# Altium schematic sheet 6 - Position2Go_Debugger.SchDoc
size A3; Release: RC00; PageSetup: Record=PageOptions|CenterHorizontal=True|CenterVertical=True|PrintScale=1.01|XCorrection=1.00|YCorrection=1.00|PrintKind=0|BorderSize=5000000|LeftOffset=0|BottomOffset=0|Orientation=2|PaperLength=1000|PaperWidth=1000|Scale=100|PaperSource=7|PrintQuality=-4|MediaType=1|DitherType=10|PaperKind=A3|PrintScaleMode=1; Doc_ConfidentialStatus: <Doc_ConfidentialStatus>; Doc_Preliminary: <Doc_Preliminary>
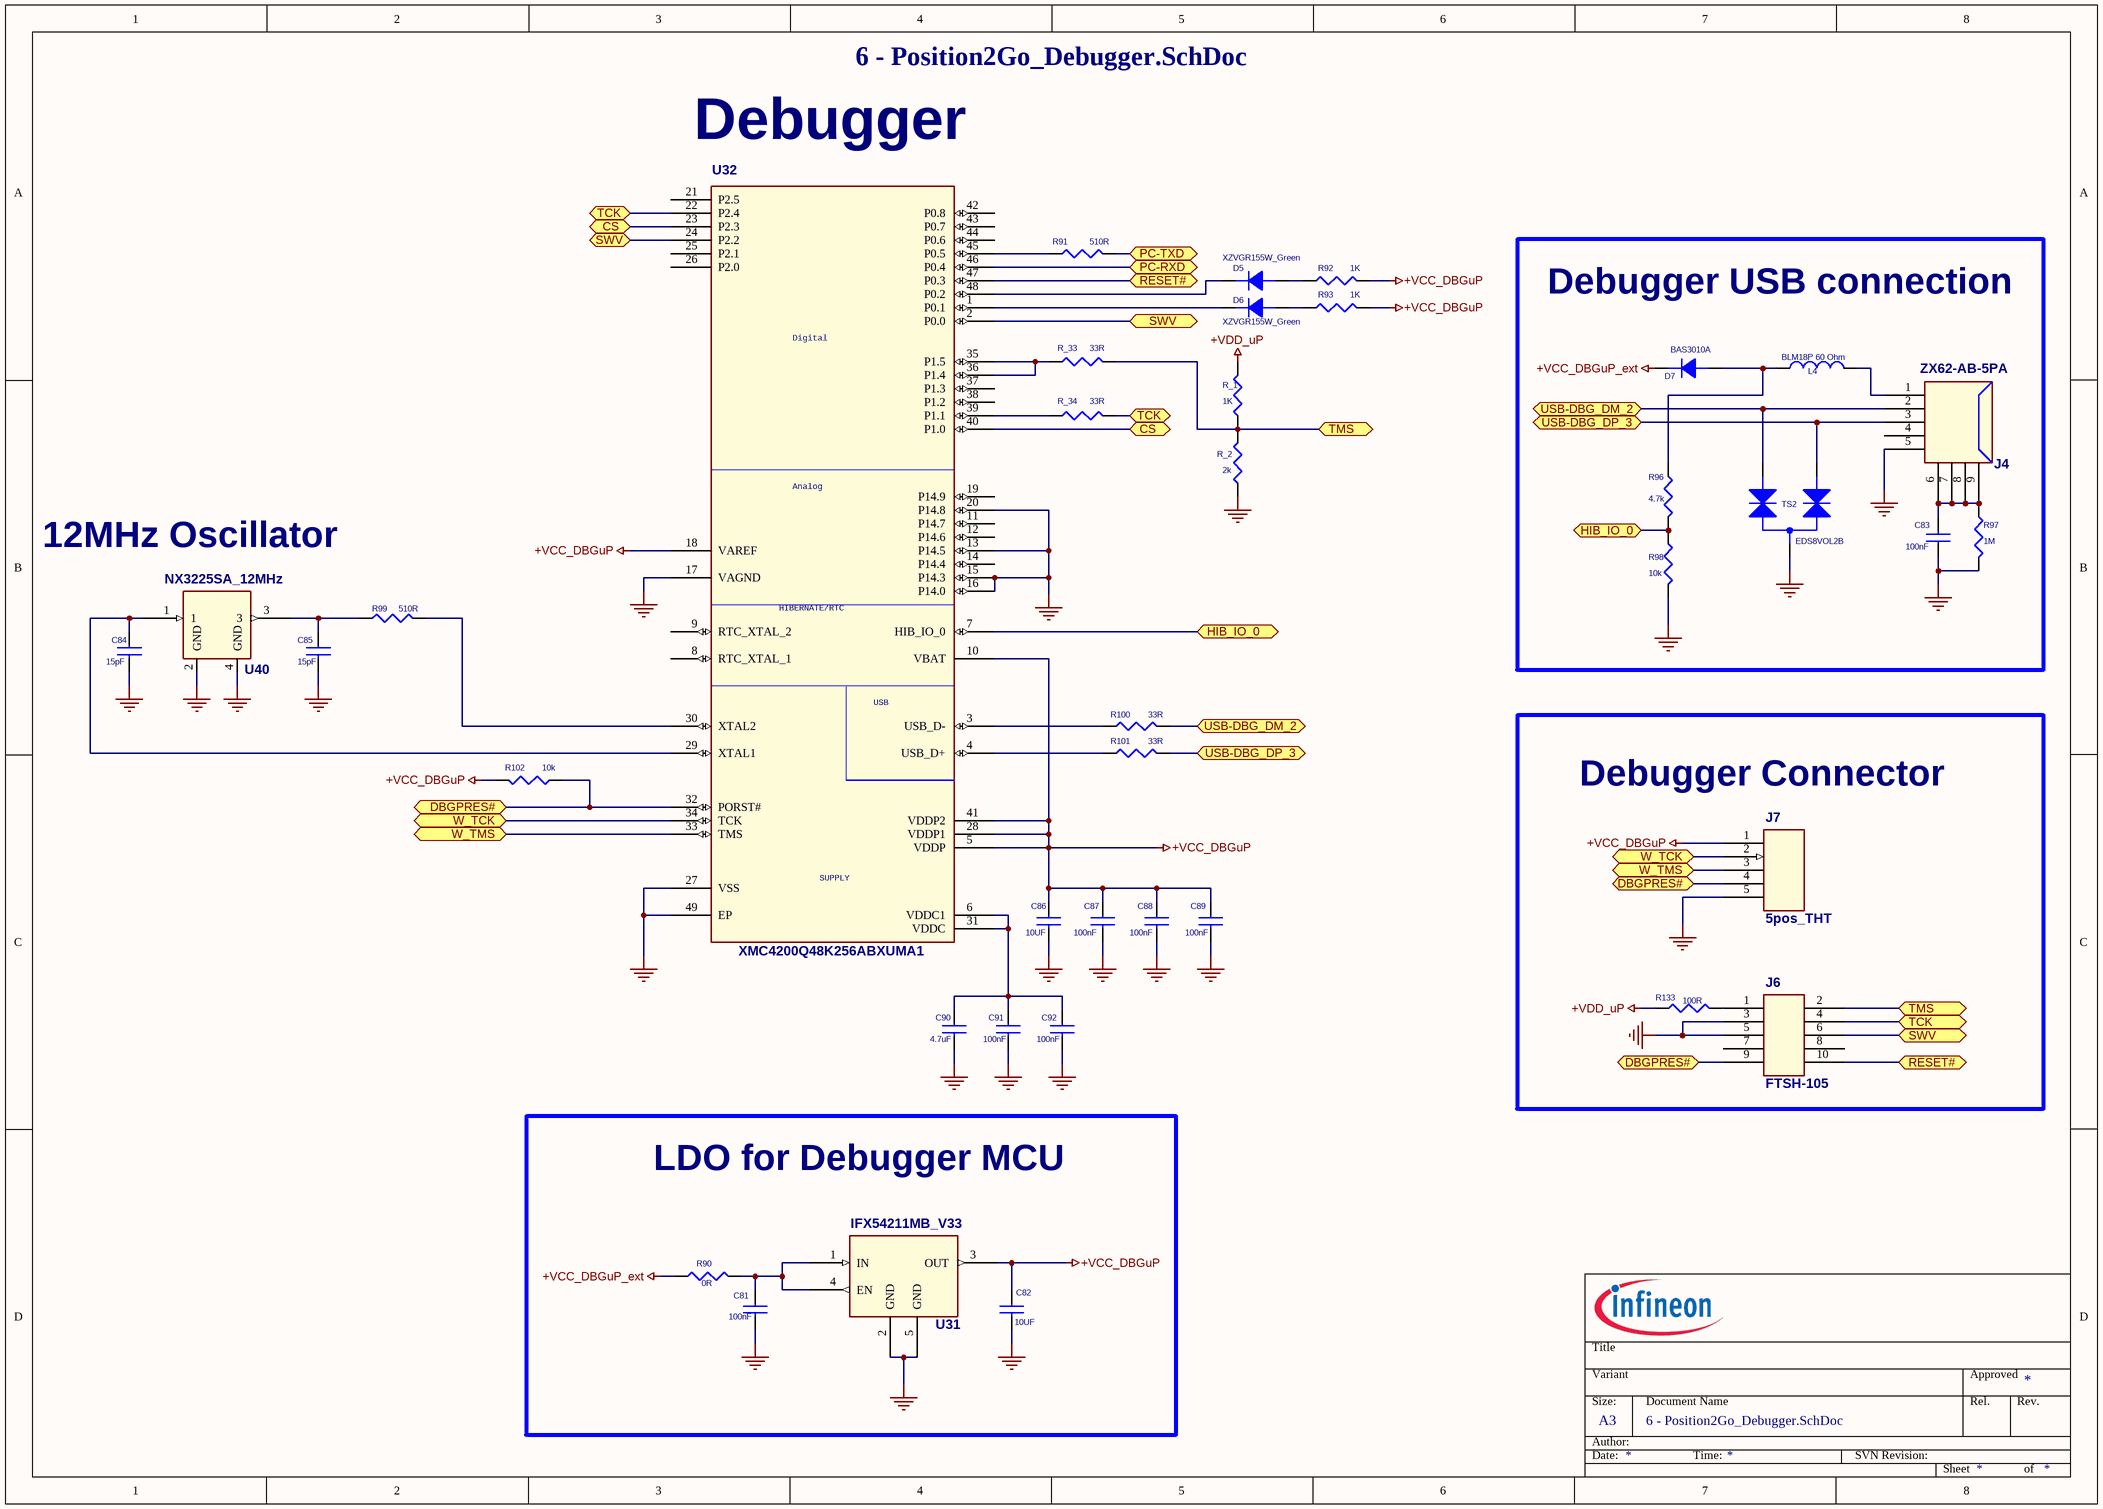
[diagram p0: 6 - Position2Go_Debugger.SchDoc]

## Parts
C81  100nF  [0402_durac]
C82  10UF  [0402_durac]
C83  100nF  [0402_durac]
C84  15pF  [0402_durac]
C85  15pF  [0402_durac]
C86  10UF  [0402_durac]
C87  100nF  [0402_durac]
C88  100nF  [0402_durac]
C89  100nF  [0402_durac]
C90  4.7uF  [0402_durac]
C91  100nF  [0402_durac]
C92  100nF  [0402_durac]
D5  XZVGR155W_Green  [LED_0201]
D6  XZVGR155W_Green  [LED_0201]
D7  BAS3010A  [sod323]
J4  ZX62-AB-5PA  [micro_AB_ZX62]
J6  FTSH-105  [CON_10_pin_uP_FTSH]
J7  5pos_THT  [con_5pin_254p]
L4  BLM18P 60 Ohm  [L_0603]
R90  0R  [0402_durac]
R91  510R  [0402_durac]
R92  1K  [R_0201]
R93  1K  [R_0201]
R96  4.7k  [0402_durac]
R97  1M  [0402_durac]
R98  10k  [0402_durac]
R99  510R  [0402_durac]
R100  33R  [0402_durac]
R101  33R  [0402_durac]
R102  10k  [0402_durac]
R133  100R  [0402_durac]
R_1  1K  [R_0201]
R_2  2k  [R_0201]
R_33  33R  [R_0201]
R_34  33R  [R_0201]
TS2  EDS8VOL2B  [ESD8VOL2B]
U31  IFX54211MB_V33  [inf-pg-sct595v]
U32  XMC4200Q48K256ABXUMA1  [inf-pg-vqfn-48-_-5200x5200tp_n]
U40  NX3225SA_12MHz  [NX3225SA]

## Blocks framed on the sheet
Debugger USB connection: C83 D7 J4 L4 R96-R98 TS2
Debugger Connector: J6 J7 R133
LDO for Debugger MCU: C81 C82 R90 U31

## Ports
CS (bidir), DBGPRES# (bidir), HIB_IO_0 (bidir), PC-RXD (bidir), PC-TXD (bidir), RESET# (bidir), SWV (bidir), TCK (bidir), TMS (bidir), USB-DBG_DM_2 (bidir), USB-DBG_DP_3 (bidir), W_TCK (bidir), W_TMS (bidir)

## Nets
+VCC_DBGuP: C82.1 C86.1 C87.1 C88.1 C89.1 J7.1 R92.2 R93.2 R102.2 U31.3(OUT) U32.5(VDDP) U32.10(VBAT) U32.18(VAREF) U32.28(VDDP1) U32.41(VDDP2)
+VCC_DBGuP_ext: D7.1(K) R90.1
+VDD_uP: R133.2 R_1.2
GND_POWER: C81.2 C82.2 C83.1 C84.2 C85.2 C86.2 C87.2 C88.2 C89.2 C90.2 C91.2 C92.2 J4.5 J6.3 J6.5 J7.5 R97.2 R98.2 R_2.1 TS2.3 U31.2(GND) U31.5(GND) U32.13(P14.5) U32.15(P14.3) U32.16(P14.0) U32.17(VAGND) U32.20(P14.8) U32.27(VSS) U32.49(EP) U40.2(GND) U40.4(GND)
CS: U32.23(P2.3) U32.40(P1.0) ; port CS
DBGPRES#: J6.9 J7.4 R102.1 U32.32(PORST#) ; port DBGPRES#
HIB_IO_0: R96.2 R98.1 U32.7(HIB_IO_0) ; port HIB_IO_0
PC-RXD: U32.46(P0.4) ; port PC-RXD
PC-TXD: R91.2 ; port PC-TXD
RESET#: J6.10 U32.47(P0.3) ; port RESET#
SWV: J6.6 U32.2(P0.0) U32.24(P2.2) ; port SWV
TCK: J6.4 R_34.2 U32.22(P2.4) ; port TCK
TMS: J6.2 R_1.1 R_2.2 R_33.2 ; port TMS
USB-DBG_DM_2: J4.2 R100.2 TS2.1 ; port USB-DBG_DM_2
USB-DBG_DP_3: J4.3 R101.2 TS2.2 ; port USB-DBG_DP_3
W_TCK: J7.2 U32.34(TCK) ; port W_TCK
W_TMS: J7.3 U32.33(TMS) ; port W_TMS
NetC81_1: C81.1 R90.2 U31.1(IN) U31.4(EN)
NetC83_2: C83.2 J4.6(GND) J4.7(GND) J4.8(GND) J4.9(GNd) R97.1
NetC84_1: C84.1 U32.29(XTAL1) U40.1
NetC85_1: C85.1 R99.1 U40.3
NetC90_1: C90.1 C91.1 C92.1 U32.6(VDDC1) U32.31(VDDC)
NetD5_1: D5.1(K) U32.48(P0.2)
NetD5_2: D5.2(A) R92.1
NetD6_1: D6.1(K) U32.1(P0.1)
NetD6_2: D6.2(A) R93.1
NetD7_2: D7.2(A) L4.2 R96.1
NetJ4_1: J4.1 L4.1
NetJ6_1: J6.1 R133.1
NetR91_1: R91.1 U32.45(P0.5)
NetR99_2: R99.2 U32.30(XTAL2)
NetR100_1: R100.1 U32.3(USB_D-)
NetR101_1: R101.1 U32.4(USB_D+)
NetR_33_1: R_33.1 U32.35(P1.5) U32.36(P1.4)
NetR_34_1: R_34.1 U32.39(P1.1)

Not connected (* = marked no-connect by the designer): J4 4; J6 7 8; U32 8(RTC_XTAL_1) 9(RTC_XTAL_2) 11(P14.7) 12(P14.6) 14(P14.4) 19(P14.9) 21(P2.5) 25(P2.1) 26(P2.0) 37(P1.3) 38(P1.2) 42(P0.8) 43(P0.7) 44(P0.6)

## Notes on the sheet
- (near U32) Debugger
- 12MHz Oscillator
- Title
- Variant
- Approved
- Date:
- Author:
- Size:
- A3
- Document Name
- Time:
- SVN Revision:
- Rel.
- Rev.
- Sheet
- of
- (in symbol XMC4200_VQFN48) Digital; Analog; HIBERNATE/RTC; USB; SUPPLY

## Library data of the parts
C81 C87-C89 C91 C92 = 100nF: 100nF  ±5%  16V  X7R; code_DK: 490-6327-2-ND; Temperature coefficient: X7R; Tolerance: 5%; Part Type: capacitor\ceramic; Voltage: 16V
C82 C86 = 10UF: Temperature coefficient: X5R; Tolerance: 20%; Voltage: 10V; code_DK: 1276-1450-1-ND; Part Type: capacitor\ceramic
C83 = CAP NP: 100nF  ±5%  16V  X7R; code_DK: 490-6327-1-ND
C84 C85 = 15pF: Temperature coefficient: NP0; Tolerance: +-0.1pF; Voltage: 50V; code_DK: 490-6200-1-ND; code_DK_Reel: 490-6212-6-ND; Part Type: capacitor\ceramic
C90 = 4.7UF: code_DK: 445-13820-1-ND; Voltage: 10V; Tolerance: 10%; Temperature coefficient: X5R; Part Type: capacitor\ceramic
D5 D6 = LED_0201_GREEN: code_DK_reel: 475-1193-6-ND; code_DK: 1497-1300-1-ND
D7 = BAS3010A: code_DK: BAS3010A-03WE6327INCT-ND
J4 = CON_MICRO_AB: code_DK: H11580TR-ND
J6 = CON_10_pin_uP_FTSH: code_DK: SAM8799-ND
J7 = 5pos_TH_passo2_54: code_DK: 732-5318-ND
L4 = blm18 p 60 ohm: code_DK: 490-1036-1-ND
R90 = 0_Dup1: 04 0402; Power: 0.063W; tolerance: 1%; code_DK: 311-0.0JRTR-ND; size: 0402
R91 R99 = 510: Power: 0.063W; tolerance: 1%; code_DK: 311-510LRTR-ND; size: 0402
R92 R93 R_1 = 1K: Power: 0.063W; tolerance: 1%; code_DK: 311-1KMCT-ND; size: 0201
R96 = 4.7K: code_DK: 311-4.7KLRTR-ND; tolerance: 1%; Power: 0.063W; size: 0402
R97 = RESISTOR: code_DK: 311-1.00MLRTR-ND
R98 R102 = 10K: code_DK: 311-10.0KLRTR-ND; tolerance: 1%; Power: 0.063W; size: 0402
R100 R101 = 33: Power: 0.063W; tolerance: 1%; code_DK: 311-33.0LRTR-ND; size: 0402
R133 = RESISTOR: code_DK: 311-100LRTR-ND
R_2 R_33 R_34 = 1K: Power: 0.063W; tolerance: 1%; size: 0201
TS2 = ESD8VOL2B: code_DK: ESD8V0L2B-03LE6327INCT-ND
U31 = IFX54211MB_V33: code_DK: NN; code_MO: 726-IFX54211MBV33HTM
U32 = XMC4200_VQFN48: code_DK: XMC4200Q48K256ABXUMA1CT-ND
U40 = NX3225SA_12MHZ: NX3225SA-12.000M-STD-CRS-2; code_DK: 644-1128-2-ND; Manufacturer Part Number: NX3225SA-12.000M-STD-CRS-2